# Altium schematic sheet Main.SchDoc
size A4; DocumentNumber: 1; SheetNumber: 1; SheetTotal: 10
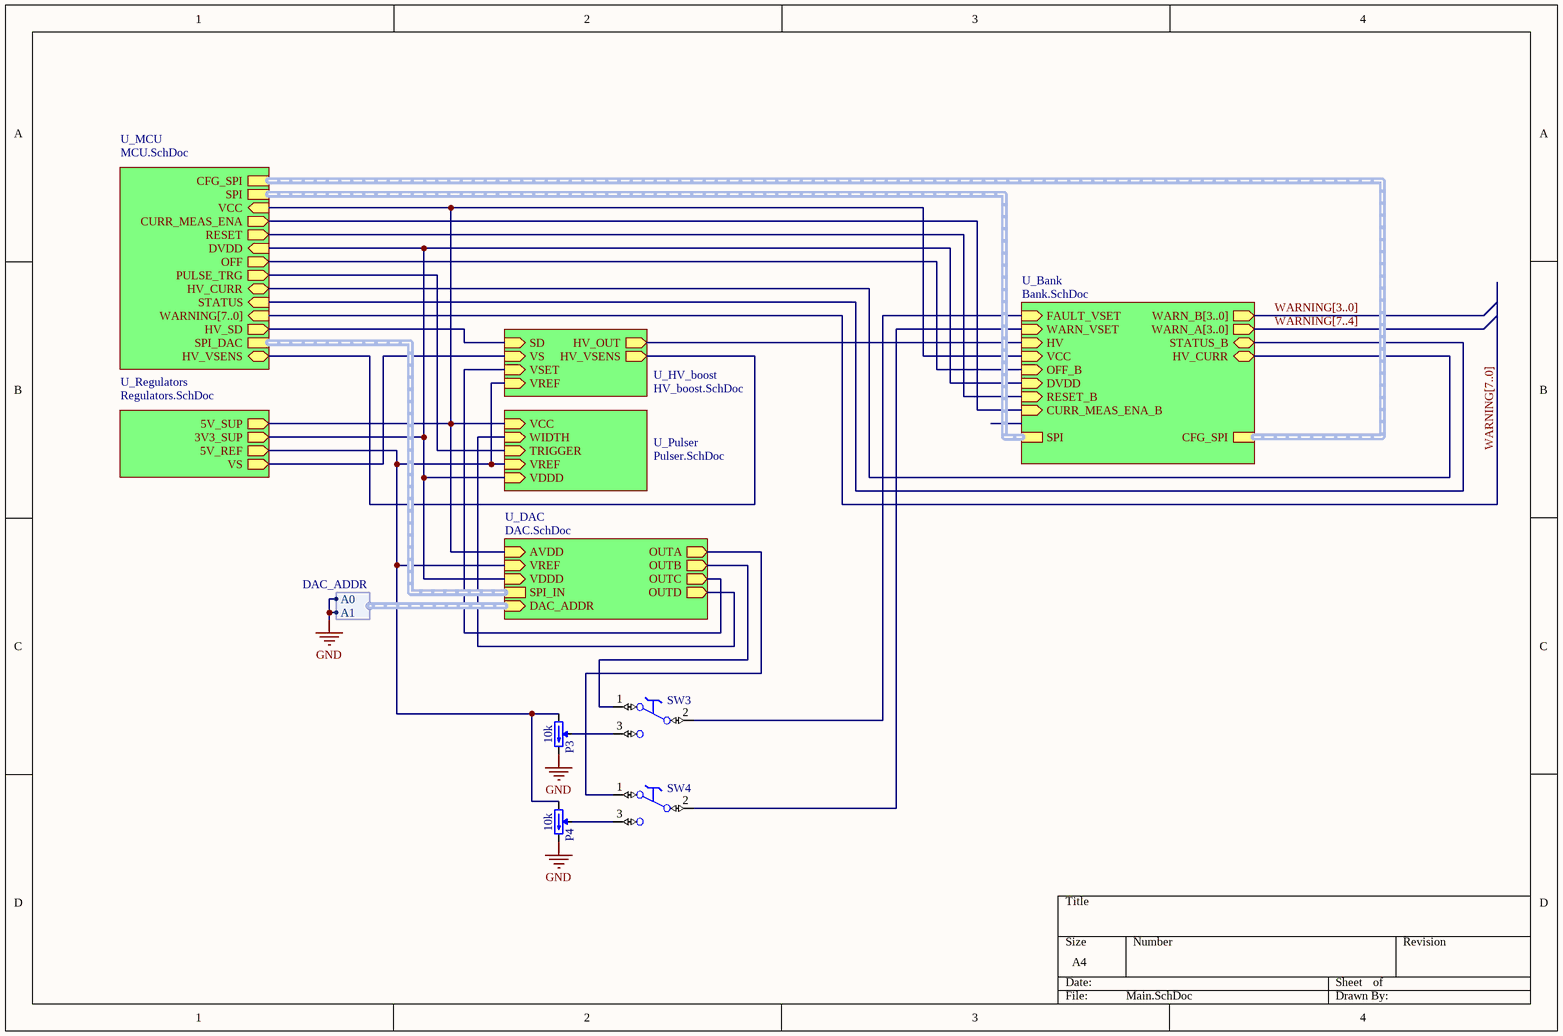
[diagram p0: Main.SchDoc]

## Parts
P3  10k  [TRIM_BOURNS_3266W]
P4  10k  [TRIM_BOURNS_3266W]
SW3  Switch  [SW_TYCO_1-1437575-4]  (value not drawn)
SW4  Switch  [SW_TYCO_1-1437575-4]  (value not drawn)

## Sub-sheets
U_Bank = Bank.SchDoc: FAULT_VSET (in), WARN_VSET (in), HV (in), VCC (in), OFF_B (in), DVDD (in), RESET_B (in), CURR_MEAS_ENA_B (in), SPI (harness SPI), CFG_SPI (harness CFG_SPI), WARN_B[3..0] (out), WARN_A[3..0] (out), STATUS_B (bidir), HV_CURR (bidir)
U_DAC = DAC.SchDoc: AVDD (in), VREF (in), VDDD (in), SPI_IN (harness SPI_DAC), DAC_ADDR (in, harness DAC_ADDR), OUTA (out), OUTB (out), OUTC (out), OUTD (out)
U_HV_boost = HV_boost.SchDoc: VS (in), HV_OUT (out), SD (in), VSET (in), VREF (in), HV_VSENS (out)
U_MCU = MCU.SchDoc: STATUS (in), OFF (out), RESET (out), CURR_MEAS_ENA (out), SPI (harness SPI), CFG_SPI (harness CFG_SPI), WARNING[7..0] (in), DVDD (in), VCC (in), HV_CURR (bidir), PULSE_TRG (out), HV_SD (out), SPI_DAC (harness SPI_DAC), HV_VSENS (bidir)
U_Pulser = Pulser.SchDoc: VCC (in), WIDTH (in), TRIGGER (in), VREF (in), VDDD (in)
U_Regulators = Regulators.SchDoc: 5V_SUP (out), 3V3_SUP (out), 5V_REF (out), VS (out)

## Harnesses
DAC_ADDR: A0, A1

## Nets
GND: P3.3(CW) P4.3(CW) ; sheet U_DAC/DAC_ADDR.A0, sheet U_DAC/DAC_ADDR.A1
NetP3_1: P3.1(CCW) P4.1(CCW) ; sheet U_Pulser/VREF, sheet U_HV_boost/VREF, sheet U_DAC/VREF, sheet U_Regulators/5V_REF
NetP3_2: P3.2(W) SW3.3(NO)
NetP4_2: P4.2(W) SW4.3(NO)
NetSW3_1: SW3.1(NC) ; sheet U_DAC/OUTB
NetSW3_2: SW3.2(C) ; sheet U_Bank/FAULT_VSET
NetSW4_1: SW4.1(NC) ; sheet U_DAC/OUTA
NetSW4_2: SW4.2(C) ; sheet U_Bank/WARN_VSET
(unnamed): sheet U_Pulser/VCC, sheet U_MCU/VCC, sheet U_Bank/VCC, sheet U_DAC/AVDD, sheet U_Regulators/5V_SUP
(unnamed): sheet U_Pulser/WIDTH, sheet U_DAC/OUTD
(unnamed): sheet U_Pulser/TRIGGER, sheet U_MCU/PULSE_TRG
(unnamed): sheet U_Pulser/VDDD, sheet U_MCU/DVDD, sheet U_Bank/DVDD, sheet U_DAC/VDDD, sheet U_Regulators/3V3_SUP
(unnamed): sheet U_HV_boost/VS, sheet U_Regulators/VS
(unnamed): sheet U_HV_boost/HV_OUT, sheet U_Bank/HV
(unnamed): sheet U_HV_boost/SD, sheet U_MCU/HV_SD
(unnamed): sheet U_HV_boost/VSET, sheet U_DAC/OUTC
(unnamed): sheet U_HV_boost/HV_VSENS, sheet U_MCU/HV_VSENS
(unnamed): sheet U_MCU/STATUS, sheet U_Bank/STATUS_B
(unnamed): sheet U_MCU/OFF, sheet U_Bank/OFF_B
(unnamed): sheet U_MCU/RESET, sheet U_Bank/RESET_B
(unnamed): sheet U_MCU/CURR_MEAS_ENA, sheet U_Bank/CURR_MEAS_ENA_B
(unnamed): sheet U_MCU/HV_CURR, sheet U_Bank/HV_CURR

## Buses and harness runs
bus WARNING[3..0] = sheet U_Bank/WARN_B[3..0]
bus WARNING[7..0] = sheet U_MCU/WARNING[7..0]
bus WARNING[7..4] = sheet U_Bank/WARN_A[3..0]
harness sheet U_Bank/CFG_SPI = sheet U_MCU/CFG_SPI
harness sheet U_Bank/SPI = sheet U_MCU/SPI
harness sheet U_DAC/SPI_IN = sheet U_MCU/SPI_DAC

## Library data of the parts
P3 P4 = TRIM_12T_10K_BOURNS_3266W-1-103LF: Trimming Potentiometer; Part Description: 12 Turn Trimming Potentiometer (Top Adjustement); Manufacturer: BOURNS; Power: 0.25W; TC: ±100ppm/°C; Tolerance: ±10%; PressFit: No; Part Number: TRIM_12T_10K_BOURNS_3266W-1-103LF; Component Kind: Standard; Component Type: Standard; Pin Count: 3; Value: 10k; Manufacturer Part Number: 3266W-1-103LF; Case: 3266W; Mounted: Yes; Socket: No; SMD: No; Sense: No; ComponentHeight: 7.75mm; HelpURL: \\cern.ch\dfs\Applications\Altium\Datasheets\TRIM_BOURNS_3266W.pdf; Author: CERN DEM JLC; CreateDate: 10.06.2008; LatestRevisionDate: 28.11.2012
SW3 SW4 = SW_TYCO_1-1437575-4: SPDT Switch; Part Description: 30VDC, 100mA, Slide Low Profile SPDT Switch, SSA Series; Manufacturer: TYCO; Manufacturer Part Number: 1-1437575-4 or SSA-12; PressFit: No; Part Number: SW_TYCO_1-1437575-4; Component Kind: Standard; Component Type: Standard; Pin Count: 3; PackageDescription: Body 8.79 x 3.4mm, Slide Low Profile SPDT Switch, SSA Series; Family: Switch; Mounted: Yes; Socket: No; SMD: No; Sense: No; Status: None; ComponentHeight: 5.4mm; HelpURL: \\cern.ch\dfs\Applications\Altium\Datasheets\SW_TYCO_1-1437575-4.pdf; Author: CERN DEM JLC; CreateDate: 11.11.2013; LatestRevisionDate: 11.11.2013